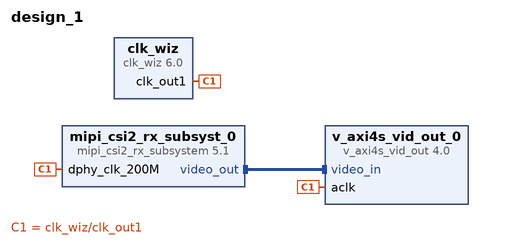
[diagram p0: block diagram of the top level]
# Vivado block design design_1, xc7a50tcpg236-1, Vivado 2020.2
create_bd_design design_1

create_bd_cell -type ip -vlnv xilinx.com:ip:mipi_csi2_rx_subsystem:5.1 mipi_csi2_rx_subsyst_0
set_property -dict {CONFIG.CMN_NUM_LANES 2 CONFIG.C_DPHY_LANES 2} [get_bd_cells mipi_csi2_rx_subsyst_0]
create_bd_cell -type ip -vlnv xilinx.com:ip:clk_wiz:6.0 clk_wiz
set_property -dict {CONFIG.USE_LOCKED false CONFIG.USE_RESET false} [get_bd_cells clk_wiz]
create_bd_cell -type ip -vlnv xilinx.com:ip:v_axi4s_vid_out:4.0 v_axi4s_vid_out_0
set_property -dict {CONFIG.C_S_AXIS_VIDEO_DATA_WIDTH 8 CONFIG.C_S_AXIS_VIDEO_FORMAT 12} [get_bd_cells v_axi4s_vid_out_0]

# ---- connections ----

connect_bd_intf_net [get_bd_intf_pins mipi_csi2_rx_subsyst_0/video_out] [get_bd_intf_pins v_axi4s_vid_out_0/video_in]
connect_bd_net [get_bd_pins clk_wiz/clk_out1] [get_bd_pins mipi_csi2_rx_subsyst_0/dphy_clk_200M] [get_bd_pins v_axi4s_vid_out_0/aclk]

validate_bd_design
save_bd_design
